# EAGLE design CatchTheLED (EAGLE 7.7.0)
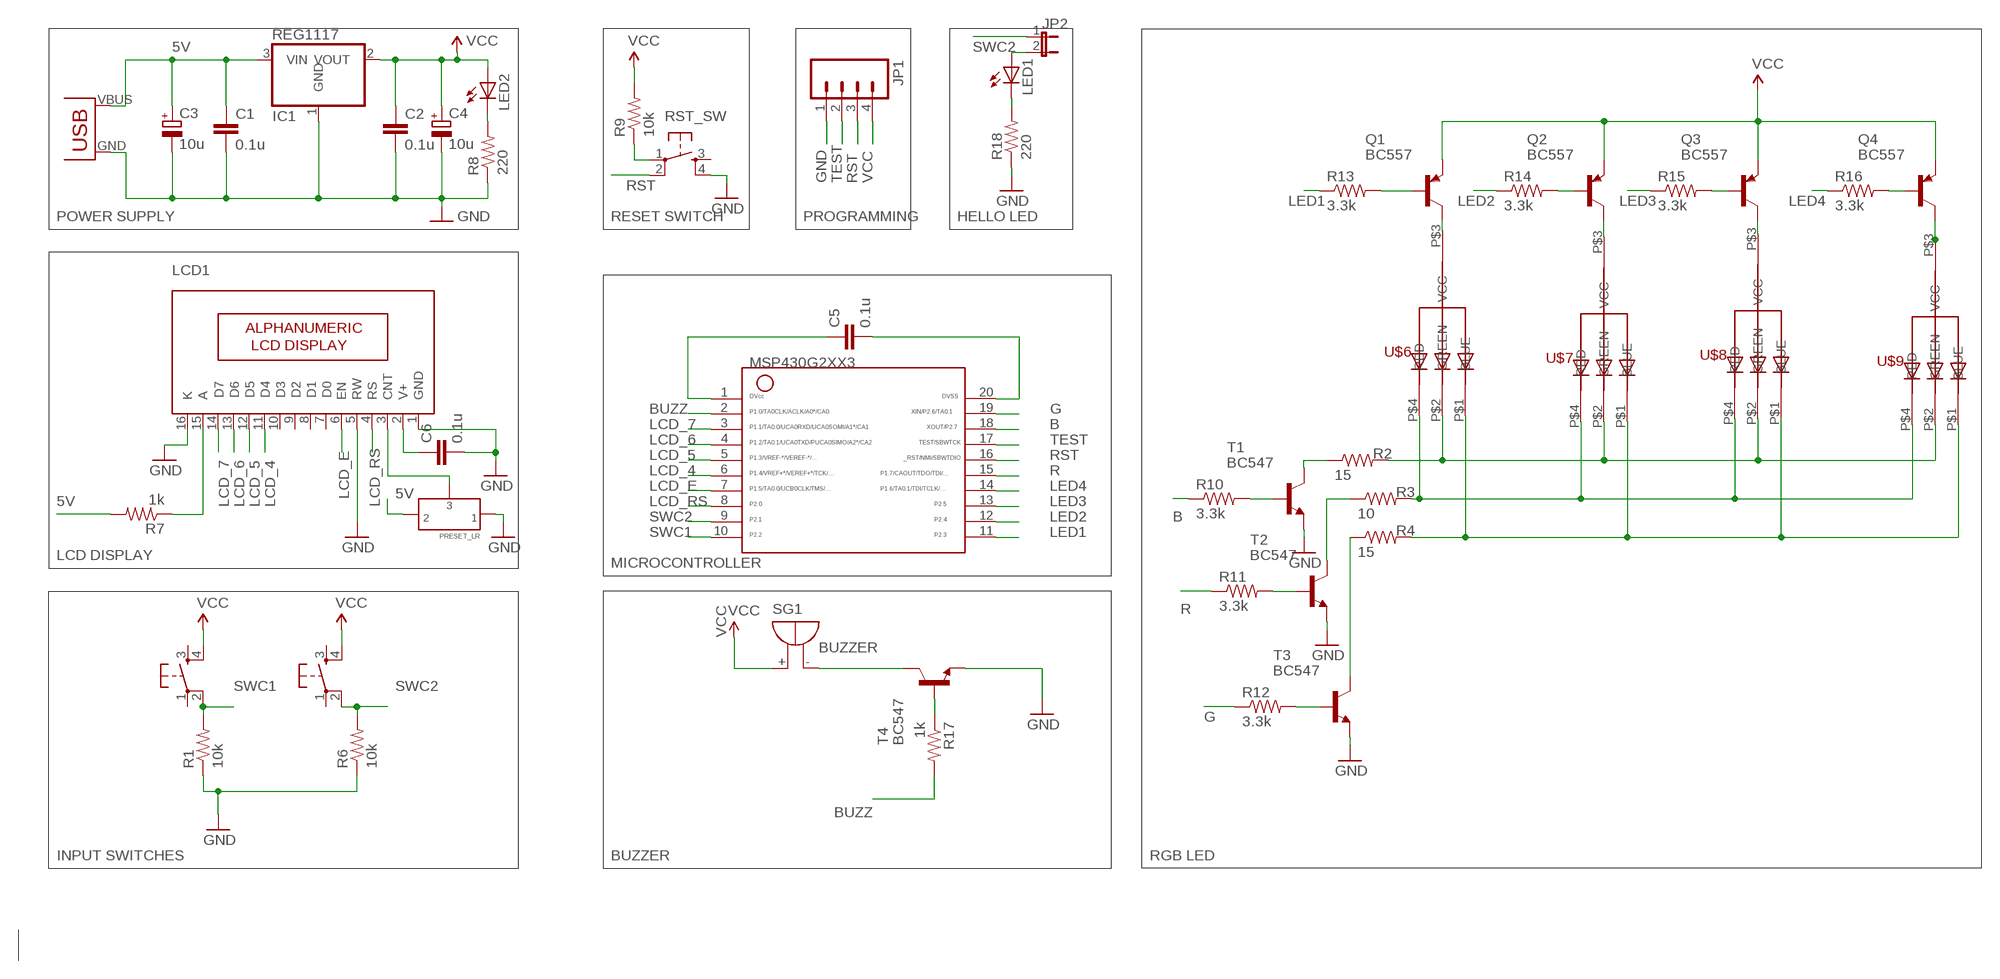
[diagram p0: schematic, sheet 1]

## Parts
C1  0.1u  C-EU025-025X050  [C025-025X050]
C2  0.1u  C-EU025-025X050  [C025-025X050]
C3  10u  CPOL-EUE2.5-5  [E2,5-5]
C4  10u  CPOL-EUE2.5-5  [E2,5-5]
C5  0.1u  C-EU025-025X050  [C025-025X050]
C6  0.1u  C-EU025-025X050  [C025-025X050]
IC1  REG1117  [SOT223]
JP1  M04  [04P]
JP2  JP1E  [JP1]
LCD1  16X2LCD  [16X2_LCD]
LED1  LED3MM  [LED3MM]
LED2  LED3MM  [LED3MM]
Q1  BC557  [TO92]
Q2  BC557  [TO92]
Q3  BC557  [TO92]
Q4  BC557  [TO92]
R1  10k  RESISTOR0207/7  [0207/7]
R2  15  RESISTOR0207/7  [0207/7]
R3  10  RESISTOR0207/7  [0207/7]
R4  15  RESISTOR0207/7  [0207/7]
R6  10k  RESISTOR0207/7  [0207/7]
R7  1k  RESISTOR0207/7  [0207/7]
R8  220  RESISTOR0207/7  [0207/7]
R9  10k  RESISTOR0207/7  [0207/7]
R10  3.3k  RESISTOR0207/7  [0207/7]
R11  3.3k  RESISTOR0207/7  [0207/7]
R12  3.3k  RESISTOR0207/7  [0207/7]
R13  3.3k  RESISTOR0207/7  [0207/7]
R14  3.3k  RESISTOR0207/7  [0207/7]
R15  3.3k  RESISTOR0207/7  [0207/7]
R16  3.3k  RESISTOR0207/7  [0207/7]
R17  1k  RESISTOR0207/7  [0207/7]
R18  220  RESISTOR0207/7  [0207/7]
RST_SW  OMRON_SWITCH_10-XX  [B3F-10XX]
SG1  BUZZER  [F/TMB]
T1  BC547  [TO92]
T2  BC547  [TO92]
T3  BC547  [TO92]
T4  BC547  [TO92]
U$1  USB(POWER)  [USB(POWER)]
U$2  MSP430G2553DIP20  [G2553-DIP20]
U$3  OMRON_SWITCH_40-XX  [B3F-40XX]
U$4  OMRON_SWITCH_40-XX  [B3F-40XX]
U$5  PRESET_LR  [PRESET_LR]
U$6  5MMRGBLED  [LED5MMRGB]
U$7  5MMRGBLED  [LED5MMRGB]
U$8  5MMRGBLED  [LED5MMRGB]
U$9  5MMRGBLED  [LED5MMRGB]

## Nets
5V: C1.1 C3.+ C6.1 IC1.3(VIN) LCD1.2(V+) R7.2 U$1.VBUS(VCC) U$5.P$2
B: R10.1 U$2.18
BUZZ: R17.2 U$2.2
G: R12.1 U$2.19
GND: C1.2 C2.2 C3.- C4.- C5.2 C6.2 IC1.1(GND) JP1.1 LCD1.1(GND) LCD1.5(RW) LCD1.16(K) R1.1 R6.1 R8.1 R18.1 RST_SW.4(S1) T1.1(E) T2.1(E) T3.1(E) T4.1(E) U$1.GND U$2.20 U$5.P$1
LCD_4: LCD1.11(D4) U$2.6
LCD_5: LCD1.12(D5) U$2.5
LCD_6: LCD1.13(D6) U$2.4
LCD_7: LCD1.14(D7) U$2.3
LCD_E: LCD1.6(EN) U$2.7
LCD_RS: LCD1.4(RS) U$2.8
LED1: R13.1 U$2.11
LED2: R14.1 U$2.12
LED3: R15.1 U$2.13
LED4: R16.1 U$2.14
N$1: R10.2 T1.2(B)
N$2: R2.2 U$6.P$2(GREEN) U$7.P$2(GREEN) U$8.P$2(GREEN) U$9.P$2(GREEN)
N$3: R3.2 U$6.P$4(RED) U$7.P$4(RED) U$8.P$4(RED) U$9.P$4(RED)
N$4: R4.2 U$6.P$1(BLUE) U$7.P$1(BLUE) U$8.P$1(BLUE) U$9.P$1(BLUE)
N$5: SG1.- T4.3(C)
N$6: Q1.3(C) U$6.P$3(VCC)
N$7: Q2.3(C) U$7.P$3(VCC)
N$8: JP2.2 LED1.A
N$9: R3.1 T2.3(C)
N$10: Q3.3(C) U$8.P$3(VCC)
N$11: LED2.K(C) R8.2
N$12: R9.1 RST_SW.1(P)
N$17: Q4.3(C) U$9.P$3(VCC)
N$28: LCD1.3(CNT) U$5.P$3
N$30: LCD1.15(A) R7.1
N$33: R11.2 T2.2(B)
N$35: R12.2 T3.2(B)
N$36: R2.1 T1.3(C)
N$38: R4.1 T3.3(C)
N$39: Q1.2(B) R13.2
N$40: Q2.2(B) R14.2
N$41: Q3.2(B) R15.2
N$42: Q4.2(B) R16.2
N$49: R17.1 T4.2(B)
N$50: LED1.K(C) R18.2
R: R11.1 U$2.15
RST: JP1.3 RST_SW.2(P1) U$2.16
SWC1: R1.2 U$2.10 U$3.2(P1)
SWC2: JP2.1 R6.2 U$2.9 U$4.2(P1)
TEST: JP1.2 U$2.17
VCC: C2.1 C4.+ C5.1 IC1.2(VOUT) JP1.4 LED2.A Q1.1(E) Q2.1(E) Q3.1(E) Q4.1(E) R9.2 SG1.+ U$2.1 U$3.4(S1) U$4.4(S1)
Unconnected: LCD1.7(D0) LCD1.8(D1) LCD1.9(D2) LCD1.10(D3) RST_SW.3(S) U$3.1(P) U$3.3(S) U$4.1(P) U$4.3(S)

## Notes on the sheet
- POWER SUPPLY | RESET SWITCH | PROGRAMMING | HELLO LED
- LCD DISPLAY
- MICROCONTROLLER
- INPUT SWITCHES | BUZZER | RGB LED

## Library data of the parts
C1 C2 C5 C6 = CPO:C-EU: CAPACITOR, European symbol
C3 C4 = CPO:CPOL-EU: POLARIZED CAPACITOR, European symbol
IC1 = CEDT_JANUARY_2015_v5:REG1117: 800mA and 1A Low Dropout (LDO) Positive Regulator 1.8V, 2.5V, 2.85V, 3.3V, 5V, and Adj
JP1 = con-amp-quick:M04: AMP QUICK CONNECTOR; OC_FARNELL: unknown; OC_NEWARK: unknown
JP2 = CPO:JP1E: JUMPER
LCD1 = CEDT_JANUARY_2015_v5:16X2LCD: ALPHANUMERIC-LCD
LED1 LED2 = CEDT_JANUARY_2015_v5:LED
Q1-Q4 = transistor-pnp:BC557: PNP Transistor
R1-R4 R6-R18 = CEDT_JANUARY_2015_v5:RESISTOR
RST_SW U$3 U$4 = CEDT_JANUARY_2015_v5:OMRON_SWITCH
SG1 = CEDT_JANUARY_2015_v5:BUZZER: BUZZER Source: Buerklin; OC_FARNELL: unknown; OC_NEWARK: unknown
T1-T4 = transistor-neu-to92:BC547: NPN TRANSISTOR
U$1 = CEDT_JANUARY_2015_v5:USB(POWER)
U$2 = CEDT_JANUARY_2015_v5:MSP430G2553
U$5 = CEDT_JANUARY_2015_v5:PRESET_LR
U$6-U$9 = led_rgb_ca_v2:5MMRGBLED

## Board
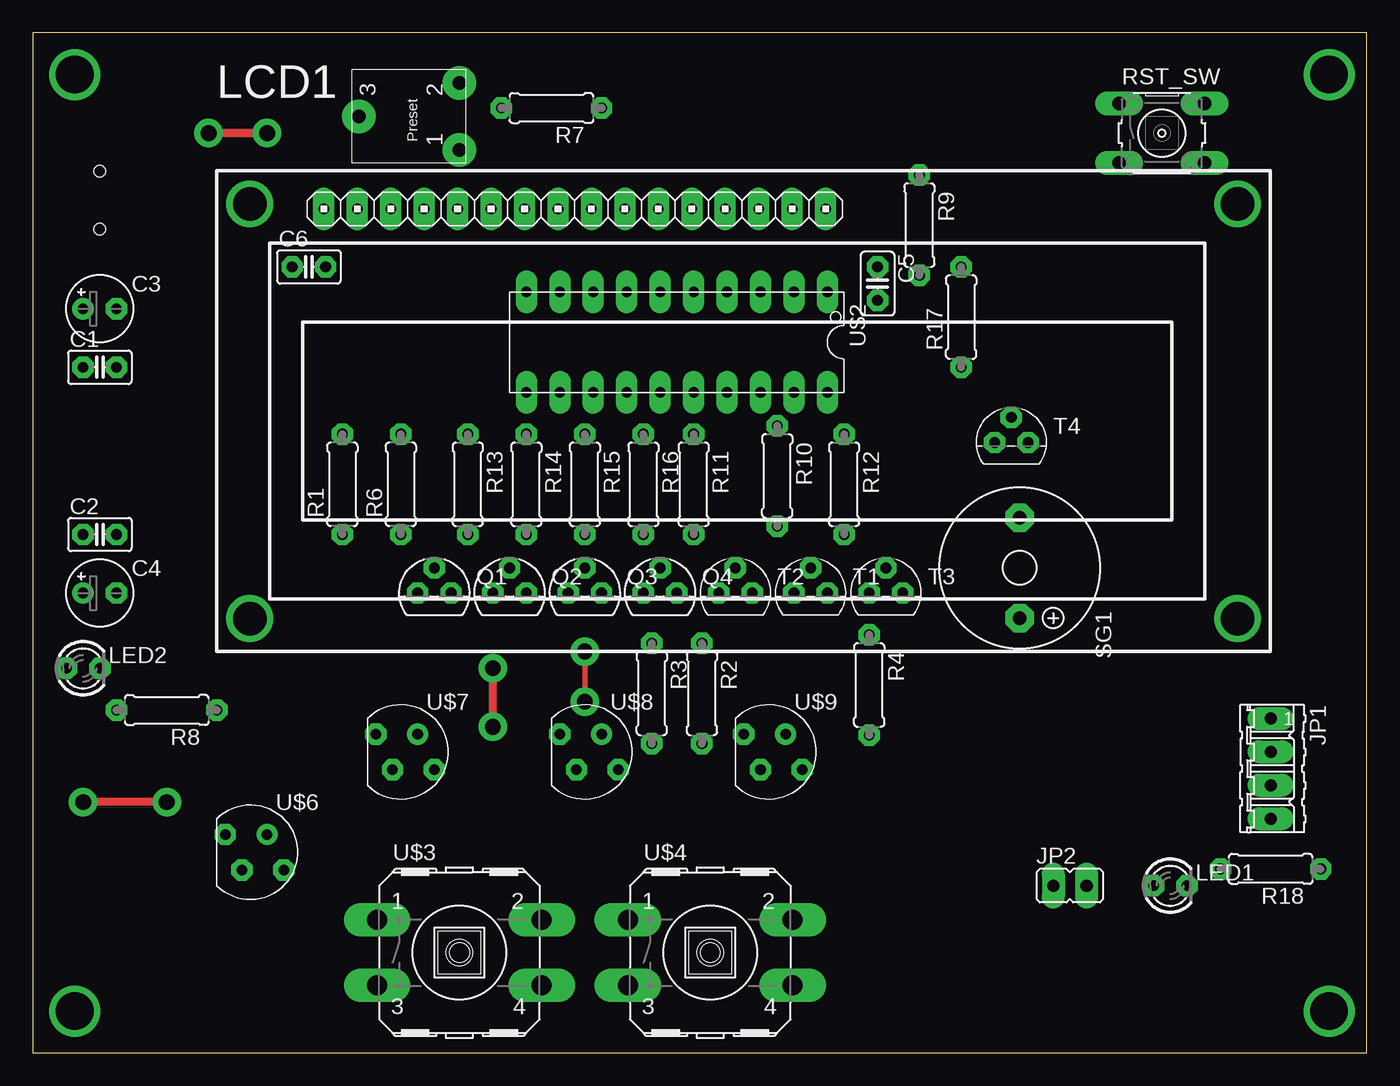
[diagram p1: board, top side]
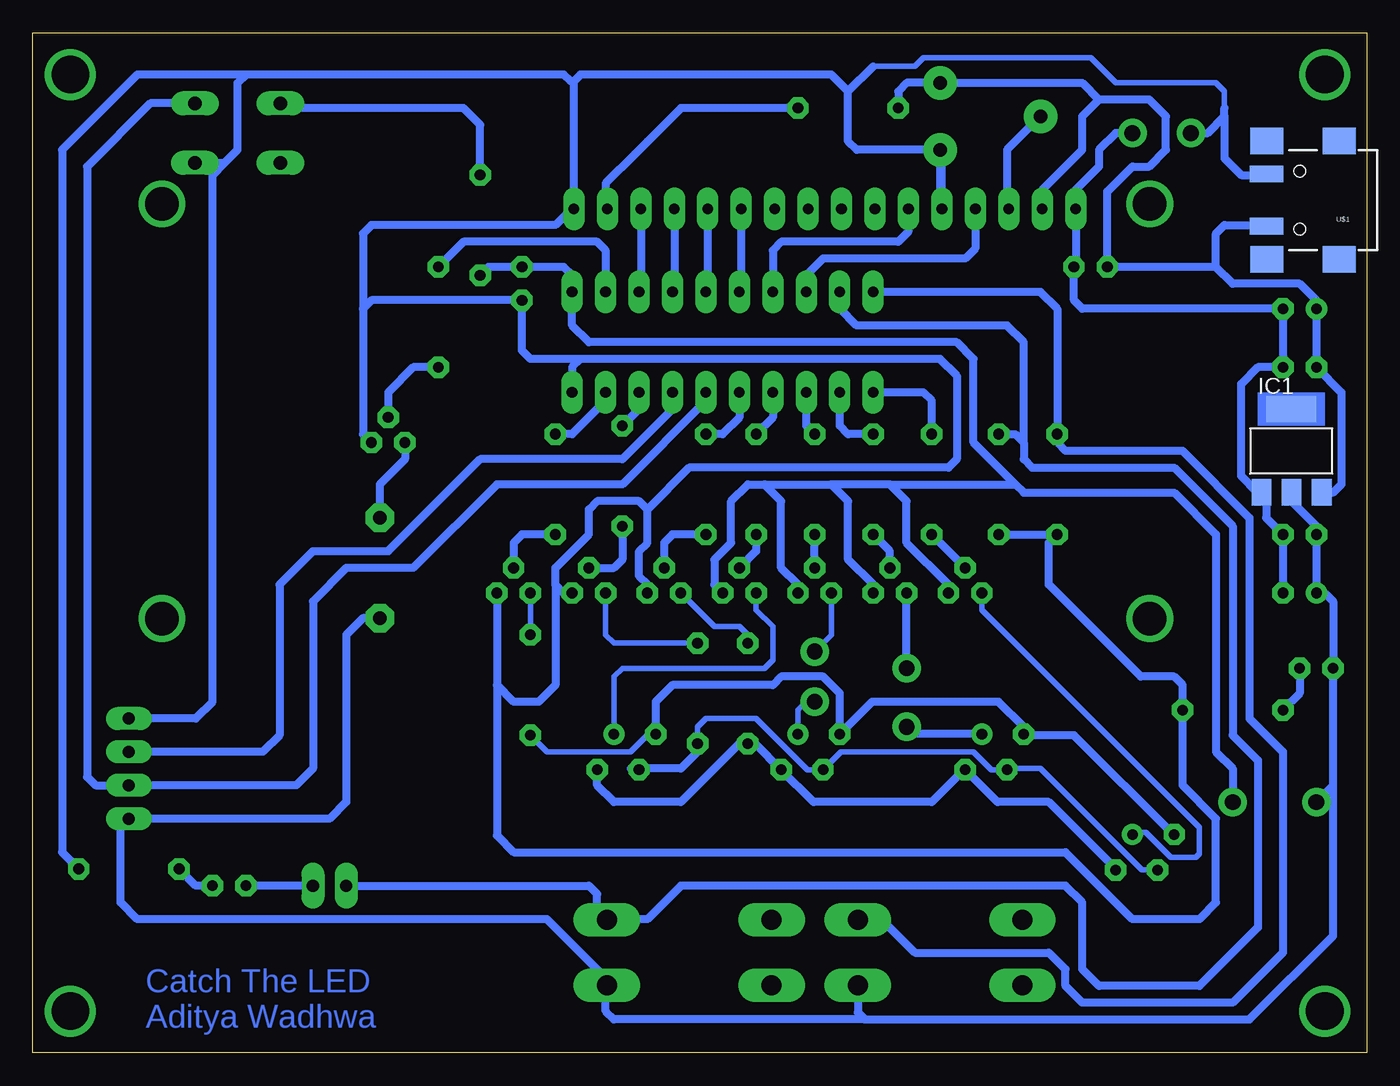
[diagram p2: board, bottom side, seen from below]

Size 101.27 x 77.46 mm. Coordinates in mm from the lower left corner, seen from the top.
Outline: 0,0 101.27,0 101.27,77.46 0,77.46 0,0
Copper layers (1*16): Top 0.035mm / dielectric 1.5mm / Bottom 0.035mm
Design rules "Indrankur *": minimum track width 16mil, minimum drill 24mil, track to track 12mil, track to pad 12mil, pad to pad 12mil, via to via 12mil, smd to smd 16mil, copper to edge 40mil, drill to drill 8mil, minimum pad ring 16mil, minimum via ring 16mil, stop-mask expansion 4mil, vias tented up to drill 0mil, thermal gap 10mil

### Footprints (pad centres in the part's own frame; a part is rotated, then mirrored left to right if it is on the bottom)
C025-025X050 = drill 0.813 octagon: 1 -1.27,0; 2 1.27,0
E2,5-5 = drill 0.813 pad 1.6: + -1.27,0 | drill 0.813 pad 1.6 octagon: - 1.27,0
SOT223 = smd 1.499 x 2.007: 1 -2.261,-3.15; 2 0.025,-3.15; 3 2.311,-3.15 | smd 3.81 x 2.007: 4 0,3.15
04P = drill 0.914 long: 1 -3.81,0; 2 -1.27,0; 3 1.27,0; 4 3.81,0
JP1 = drill 0.914 long: 1 0,-1.27; 2 0,1.27
16X2_LCD = drill 0.813 long: 1 8.12,33.608; 2 10.66,33.608; 3 13.2,33.608; 4 15.74,33.608; 5 18.28,33.608; 6 20.82,33.608; 7 23.36,33.608; 8 25.9,33.608; 9 28.44,33.608; 10 30.98,33.608; 11 33.52,33.608; 12 36.06,33.608; 13 38.6,33.608; 14 41.14,33.608; 15 43.68,33.608; 16 46.22,33.608 | drill 2.54: P$1 2.5,34; P$2 2.5,2.5; P$3 77.5,2.5; P$4 77.5,34
LED3MM = drill 0.813 octagon: A -1.27,0; K 1.27,0
TO92 = drill 0.813 octagon: 1 1.27,0; 2 0,1.905; 3 -1.27,0
0207/7 = drill 0.813 octagon: 1 -3.81,0; 2 3.81,0
B3F-10XX = drill 1.016 long: 1 -3.251,2.261; 2 3.251,2.261; 3 -3.251,-2.261; 4 3.251,-2.261
F/TMB = drill 1.016 pad 2.159 octagon: + 3.81,0; - -3.81,0
USB(POWER) = smd 2.54 x 1.27: GND 2.5,-1.981; VBUS 2.5,1.981 | smd 2.5 x 2: GND@1 -3,-4.5; GND@2 -3,4.5; GND@3 2.5,4.5; GND@4 2.5,-4.5 | hole 0.9: 0,2.2; 0,-2.2
G2553-DIP20 = drill 0.813 long: 1 -10.165,-3.81; 2 -7.625,-3.81; 3 -5.085,-3.81; 4 -2.545,-3.81; 5 -0.005,-3.81; 6 2.535,-3.81; 7 5.075,-3.81; 8 7.615,-3.81; 9 10.155,-3.81; 10 12.695,-3.81; 11 12.695,3.81; 12 10.155,3.81; 13 7.615,3.81; 14 5.075,3.81; 15 2.535,3.81; 16 -0.005,3.81; 17 -2.545,3.81; 18 -5.085,3.81; 19 -7.625,3.81; 20 -10.165,3.81
B3F-40XX = drill 1.524 long: 1 -6.248,2.489; 2 6.248,2.489; 3 -6.248,-2.489; 4 6.248,-2.489
PRESET_LR = drill 1.016 pad 2.54: P$1 -2.54,-3.81; P$2 2.54,-3.81; P$3 0,3.81
LED5MMRGB = drill 0.8 pad 0.813 octagon: P$1 -1.905,1.349; P$2 -0.635,-1.349; P$4 2.54,-1.349 | drill 0.8 pad 0.813: P$3 1.27,1.349

### Placement (x,y rotation side)
C1  5.08,52.07 0 top
C2  5.08,39.37 0 top
C3  5.08,56.52 0 top
C4  5.08,34.92 0 top
C5  64.14,58.42 270 top
C6  20.95,59.69 0 top
IC1  5.71,45.72 0 bottom
JP1  93.98,21.59 270 top
JP2  78.74,12.7 270 top
LCD1  13.97,30.48 0 top
LED1  86.36,12.7 0 top
LED2  3.81,29.21 0 top
Q1  30.48,34.92 0 top
Q2  36.2,34.92 0 top
Q3  41.91,34.92 0 top
Q4  47.62,34.92 0 top
R1  23.5,43.18 90 top
R2  50.8,27.3 270 top
R3  46.99,27.3 270 top
R4  63.5,27.94 270 top
R6  27.94,43.18 90 top
R7  39.37,71.75 180 top
R8  10.16,26.04 180 top
R9  67.31,62.87 270 top
R10  56.52,43.81 270 top
R11  50.16,43.18 270 top
R12  61.59,43.18 270 top
R13  33.02,43.18 270 top
R14  37.47,43.18 270 top
R15  41.91,43.18 270 top
R16  46.35,43.18 270 top
R17  70.48,55.88 90 top
R18  93.98,13.97 180 top
RST_SW  85.72,69.85 0 top
SG1  74.93,36.83 270 top
T1  59.05,34.92 0 top
T2  53.34,34.92 0 top
T3  64.77,34.92 0 top
T4  74.3,46.35 0 top
U$1  5.08,64.77 180 bottom
U$2  50.16,53.98 180 top
U$3  32.38,7.62 0 top
U$4  51.44,7.62 0 top
U$5  28.57,71.12 90 top
U$6  16.51,15.24 0 top
U$7  27.94,22.86 0 top
U$8  41.91,22.86 0 top
U$9  55.88,22.86 0 top

### Tracks (layer width: path | path; a pad name or v marks a point on that pad's centre or on a via)
5V
  Bottom 0.61: 24.77,63.95 LCD1.2 24.63,65.54 21.59,68.58 21.59,71.12 20.32,72.39 | IC1.3 2.52,42.57 1.91,43.18 1.91,50.16 C1.1 C3.+ 3.81,57.15 5.08,58.42 10.16,58.42 11.43,59.69 | 11.43,59.69 11.43,62.23 10.79,62.87 8.29,62.87 U$1.VBUS 7.66,62.87 | 11.43,59.69 C6.1 19.68,65.41 17.78,67.31 16.51,67.31 15.24,68.58 15.24,71.12 16.51,72.39 20.32,72.39 | R7.2 35.56,73.03 34.92,73.66 U$5.P$2 21.59,73.66 20.32,72.39
B
  Bottom 0.61: U$2.18 55.25,48.89 R10.1
BUZZ
  Bottom 0.61: R17.2 68.58,61.59 58.42,61.59 57.79,60.97 U$2.2
G
  Bottom 0.61: U$2.19 57.79,49.52 60.33,46.99 R12.1
GND  (via drill 1.2 pad 1.93)
  Top 0.61: v17.78,69.85 v13.34,69.85
  Bottom 0.406: 37.47,74.93 34.29,74.93 33.66,75.56 20.95,75.56 19.05,73.66 11.43,73.66 10.79,73.03 10.79,71.75
  Bottom 0.61: 60.19,73.8 LCD1.16 60.37,64.09 61.59,62.87 75.56,62.87 76.2,62.23 76.2,56.52 | LCD1.5 32.25,64 | C4.- C2.2 7.62,40.64 7.62,42.29 IC1.1 8.28,42.57 9.53,43.81 9.53,50.8 8.26,52.07 C1.2 C3.- 21.59,56.52 22.23,57.15 C6.2 22.09,59.83 LCD1.1 22.23,64.22 22.23,65.41 20.32,67.31 20.32,68.58 19.05,69.85 v17.78,69.85 | R6.1 R1.1 24.13,38.73 24.13,35.56 17.14,28.57 14.61,28.57 13.97,27.94 R8.1 13.97,20.32 11.43,17.78 11.43,11.43 12.7,10.16 17.78,10.16 22.86,15.24 64.77,15.24 66.04,16.51 66.04,27.94 | T2.1 54.61,35.56 55.24,36.2 55.24,38.1 54.61,38.73 54.61,41.27 | 54.61,41.27 55.24,41.91 58.42,41.91 59.05,41.27 59.05,39.37 61.59,36.83 61.59,35.56 | T1.1 60.96,34.92 61.59,35.56 | 85.09,74.3 60.96,74.3 60.46,73.8 60.19,73.8 | 85.09,74.3 93.34,74.3 99.06,68.58 99.06,15.24 R18.1 | RST_SW.4 86.72,67.59 | 86.72,67.59 85.72,68.58 85.72,73.66 85.09,74.3 | 39.37,73.03 40.64,74.3 59.69,74.3 60.19,73.8 | 10.79,71.12 10.79,67.94 9.53,66.67 8.29,66.67 U$1.GND | v13.34,69.85 12.06,69.85 10.79,71.12 | 76.2,56.52 76.2,46.99 T4.1 | C5.2 64.77,57.15 | 64.77,57.15 75.56,57.15 76.2,56.52 | 86.72,67.59 87.63,66.67 87.63,26.67 88.9,25.4 JP1.1 92.71,25.4 | 54.61,41.27 51.44,44.45 31.75,44.45 31.11,45.09 31.11,51.44 32.38,52.7 59.7,52.7 | 59.7,52.7 60.33,52.07 U$2.20 | 59.7,52.7 63.5,52.7 64.14,53.34 64.14,56.52 64.77,57.15 | 10.79,71.12 10.79,71.75 | T3.1 66.04,27.94 | 61.59,35.56 61.59,27.94 62.87,26.67 64.77,26.67 66.04,27.94 | LCD1.5 32.38,64.22 U$5.P$1 33.02,68.58 | LCD1.5 32.25,67.81 33.02,68.58 | 33.02,68.58 38.73,68.58 39.37,69.22 39.37,73.03 | 39.37,73.03 37.47,74.93
LCD_4
  Bottom 0.61: LCD1.11 47.49,58.56 47.63,58.42 U$2.6
LCD_5
  Bottom 0.61: LCD1.12 50.03,57.92 U$2.5
LCD_6
  Bottom 0.61: LCD1.13 52.57,57.92 U$2.4
LCD_7
  Bottom 0.61: LCD1.14 55.11,57.92 U$2.3
LCD_E
  Bottom 0.61: LCD1.6 34.79,62.37 35.56,61.59 44.45,61.59 45.09,60.96 U$2.7
LCD_RS
  Bottom 0.61: LCD1.4 29.71,61.09 30.48,60.33 41.27,60.33 42.55,59.05 U$2.8
LED1
  Bottom 0.61: R13.1 33.02,49.53 33.66,50.16 U$2.11
LED2
  Bottom 0.61: R14.1 39.37,46.99 40.01,47.62 U$2.12
LED3
  Bottom 0.61: R15.1 42.55,47.62 U$2.13
LED4
  Bottom 0.61: U$2.14 45.09,48.26 R16.1
N$1
  Bottom 0.61: T1.2 57.15,36.83 56.52,37.47 R10.2
N$2
  Bottom 0.406: U$8.P$2 41.2,21.51 | U$8.P$2 42.47,21.51 46.35,25.4 50.16,25.4 50.8,24.77 R2.2 | U$8.P$2 39.93,22.86 29.84,22.86 28.5,21.51 U$7.P$2 27.23,21.59 24.77,21.59 17.07,13.89 U$6.P$2
  Bottom 0.61: R2.2 50.8,22.86 52.07,21.59 55.32,21.59 | 55.88,21.59 55.32,21.59 | 55.32,21.59 U$9.P$2
N$3
  Bottom 0.61: U$6.P$4 19.05,13.97 24.13,19.05 28.02,19.05 U$7.P$4 30.56,21.51 33.02,19.05 41.99,19.05 U$8.P$4 46.43,23.5 R3.2 47.62,23.5 52.07,19.05 57.15,19.05 58.42,20.32 U$9.P$4
N$4
  Bottom 0.406: U$9.P$1 54.53,24.21 55.88,22.86 62.23,22.86 R4.2
  Bottom 0.61: U$9.P$1 53.98,26.67 52.7,27.94 45.09,27.94 44.45,28.57 41.27,28.57 40.01,27.3 U$8.P$1 37.54,26.67 27.94,26.67 26.04,24.77 U$7.P$1 25.96,24.13 22.23,24.13 14.68,16.59 U$6.P$1
N$5
  Bottom 0.61: T4.3 73.03,45.09 74.93,43.18 SG1.-
N$6
  Bottom 0.406: Q1.3 29.21,33.66 12.7,17.14 12.7,15.11 12.95,14.86 14.86,14.86 16.76,16.76 17.61,16.76 U$6.P$3
N$7  (via drill 1.2 pad 1.93)
  Top 0.61: v34.92,24.77 v34.92,29.21
  Bottom 0.61: U$7.P$3 34.85,24.21 v34.92,24.77 | v34.92,29.21 Q2.3
N$8
  Bottom 0.61: JP2.2 LED1.A
N$9
  Bottom 0.406: R3.1 46.99,31.75 47.62,32.38 49.53,32.38 T2.3
N$10  (via drill 1.2 pad 1.93)
  Top 0.406: v41.91,26.67 v41.91,30.48
  Bottom 0.406: v41.91,30.48 40.64,31.75 Q3.3 | v41.91,26.67 42.55,26.67 43.18,26.04 U$8.P$3
N$11
  Bottom 0.61: LED2.K 5.08,27.3 R8.2
N$12
  Bottom 0.61: R9.1 67.31,70.48 68.58,71.75 82.12,71.75 RST_SW.1
N$13  (via drill 2.85 pad 3.81)
  other vias: 3.17,3.17
N$14  (via drill 2.85 pad 3.81)
  other vias: 98.42,3.17
N$15  (via drill 2.85 pad 3.81)
  other vias: 3.17,74.3
N$16  (via drill 2.85 pad 3.81)
  other vias: 98.42,74.3
N$17
  Bottom 0.406: Q4.3 46.35,33.66 45.09,32.38 45.09,29.84 45.72,29.21 56.52,29.21 57.15,28.57 U$9.P$3
N$28
  Bottom 0.61: 27.3,64.22 LCD1.3 | 27.3,64.22 27.3,68.58 U$5.P$3 | 27.3,64.22 27.3,64.14
N$30
  Bottom 0.61: LCD1.15 57.78,64.22 57.78,66.04 55.56,68.26 54.61,69.22 52.07,71.75 R7.1
N$33
  Bottom 0.61: R11.2 52.7,39.37 53.34,38.73 T2.2
N$35
  Bottom 0.61: R12.2 64.14,39.37 64.77,38.73 T3.2
N$36
  Bottom 0.406: R2.1 57.15,31.11 57.78,31.75 T1.3
N$38
  Bottom 0.406: T3.3 R4.1
N$39
  Bottom 0.61: Q1.2 R13.2
N$40
  Bottom 0.61: Q2.2 36.2,38.1 R14.2
N$41
  Bottom 0.61: Q3.2 R15.2
N$42
  Bottom 0.61: R16.2 46.35,38.1 Q4.2
N$49
  Bottom 0.61: T4.2 74.3,50.16 72.39,52.07 R17.1
N$50
  Bottom 0.61: LED1.K 88.9,12.7 R18.2
R
  Bottom 0.61: U$2.15 47.63,48.26 48.9,46.99 R11.1
RST
  Bottom 0.61: RST_SW.2 92.35,72.11 97.16,67.31 97.16,20.95 96.52,20.32 JP1.3 | U$2.16 50.17,49.52 56.52,43.18 66.04,43.18 72.39,36.83 77.47,36.83 80.01,34.29 80.01,21.59 81.28,20.32 JP1.3 | 92.71,20.32 JP1.3
SWC1
  Bottom 0.61: U$3.2 38.58,10.16 36.83,10.16 34.29,7.62 24.13,7.62 22.86,6.35 22.86,5.08 21.59,3.81 10.16,3.81 6.35,7.62 6.35,22.86 8.89,25.4 8.89,40.64 13.97,45.72 22.86,45.72 23.5,46.35 R1.2 23.5,56.52 24.77,57.78 U$2.10
SWC2
  Bottom 0.61: R6.2 26.67,46.99 26.04,46.35 | 26.04,46.35 26.04,45.09 25.4,44.45 14.61,44.45 10.16,40.01 10.16,24.13 8.26,22.23 8.26,9.53 12.7,5.08 20.32,5.08 21.59,6.35 21.59,11.43 22.86,12.7 52.07,12.7 54.61,10.16 57.63,10.16 U$4.2 57.78,10.21 57.84,10.21 58.42,10.79 58.42,12.06 59.05,12.7 JP2.1 | 26.04,46.35 26.04,53.98 27.3,55.24 38.73,55.24 40.01,56.52 U$2.9
TEST
  Bottom 0.61: U$2.17 52.71,48.89 56.52,45.09 67.31,45.09 74.3,38.1 80.01,38.1 82.55,35.56 82.55,24.13 83.82,22.86 JP1.2 92.71,22.86
VCC  (via drill 1.2 pad 1.93)
  Top 0.61: v10.16,19.05 v3.81,19.05
  Bottom 0.61: 45.72,43.18 40.64,43.18 | Q1.1 31.75,35.56 34.92,38.73 34.92,41.91 36.2,43.18 | Q2.1 37.47,35.56 39.37,37.47 39.37,41.91 40.64,43.18 | Q3.1 43.18,35.56 44.45,36.83 44.45,41.91 45.72,43.18 | 38.1,2.54 8.89,2.54 2.54,8.89 2.54,20.32 | 2.54,20.32 LED2.A 2.54,34.29 3.17,34.92 C4.+ C2.1 3.81,40.01 5.71,41.91 5.71,42.55 IC1.2 | U$2.1 60.33,59.05 | U$3.4 38.63,3.07 38.1,2.54 | 38.1,2.54 57.15,2.54 57.78,3.17 57.78,5.03 | 36.2,43.18 40.64,43.18 | 26.67,43.18 26.04,42.55 14.61,42.55 11.43,39.37 11.43,22.86 10.16,21.59 v10.16,19.05 | 26.67,43.18 29.84,46.35 29.84,52.7 31.11,53.98 59.05,53.98 60.33,55.24 U$2.1 | 36.2,43.18 26.67,43.18 | U$2.1 60.33,59.06 60.96,59.69 C5.1 66.67,59.69 R9.2 | U$2.1 60.33,59.05 U$2.1 | Q4.1 49.53,35.56 49.53,37.47 48.26,38.73 48.26,41.91 46.99,43.18 45.72,43.18 | SG1.+ 76.2,33.02 77.47,31.75 77.47,19.05 78.74,17.78 JP1.4 94.61,17.14 94.61,11.43 93.34,10.16 62.23,10.16 57.78,5.71 57.78,5.03 | v3.81,19.05 2.54,20.32 | 57.78,5.03 U$4.4
(copper drawn outside any net)
  shapes: Bottom area x1

### Text on the board
Bottom: Catch The LED / Aditya Wadhwa